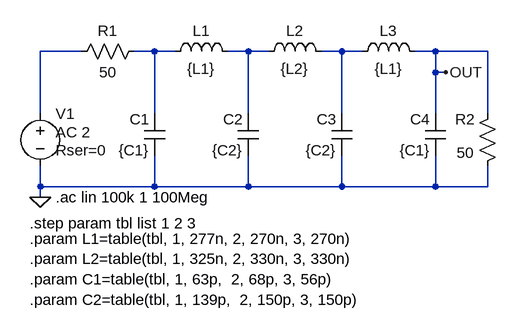
[diagram p0: schematic 40MHzLP.asc]
40MHzLP.asc, the LTspice schematic file:
Version 4
SHEET 1 1248 680
WIRE -336 -208 -400 -208
WIRE -224 -208 -256 -208
WIRE -192 -208 -224 -208
WIRE -80 -208 -112 -208
WIRE -48 -208 -80 -208
WIRE 64 -208 32 -208
WIRE 96 -208 64 -208
WIRE 208 -208 176 -208
WIRE 288 -208 208 -208
WIRE 208 -176 208 -208
WIRE 224 -176 208 -176
WIRE -400 -112 -400 -208
WIRE -224 -112 -224 -208
WIRE -80 -112 -80 -208
WIRE 64 -112 64 -208
WIRE 208 -112 208 -176
WIRE 288 -112 288 -208
WIRE -400 0 -400 -32
WIRE -224 0 -224 -48
WIRE -224 0 -400 0
WIRE -80 0 -80 -48
WIRE -80 0 -224 0
WIRE 64 0 64 -48
WIRE 64 0 -80 0
WIRE 208 0 208 -48
WIRE 208 0 64 0
WIRE 288 0 288 -32
WIRE 288 0 208 0
WIRE -400 16 -400 0
FLAG -400 16 0
FLAG 224 -176 OUT
SYMBOL ind -208 -192 R270
WINDOW 0 32 56 VTop 2
WINDOW 3 5 56 VBottom 2
SYMATTR InstName L1
SYMATTR Value {L1}
SYMBOL voltage -400 -128 R0
WINDOW 3 24 44 Left 2
WINDOW 123 24 44 Left 2
WINDOW 39 24 72 Left 2
SYMATTR Value ""
SYMATTR Value2 AC 2
SYMATTR SpiceLine Rser=0
SYMATTR InstName V1
SYMBOL res -352 -192 R270
WINDOW 0 32 56 VTop 2
WINDOW 3 0 56 VBottom 2
SYMATTR InstName R1
SYMATTR Value 50
SYMBOL cap -208 -48 R180
WINDOW 0 24 56 Left 2
WINDOW 3 24 8 Left 2
SYMATTR InstName C1
SYMATTR Value {C1}
SYMBOL cap -64 -48 R180
WINDOW 0 24 56 Left 2
WINDOW 3 24 8 Left 2
SYMATTR InstName C2
SYMATTR Value {C2}
SYMBOL ind 80 -192 R270
WINDOW 0 32 56 VTop 2
WINDOW 3 5 56 VBottom 2
SYMATTR InstName L3
SYMATTR Value {L1}
SYMBOL cap 224 -48 R180
WINDOW 0 24 56 Left 2
WINDOW 3 24 8 Left 2
SYMATTR InstName C4
SYMATTR Value {C1}
SYMBOL res 304 -128 M0
WINDOW 0 35 24 Left 2
SYMATTR InstName R2
SYMATTR Value 50
SYMBOL ind -64 -192 R270
WINDOW 0 32 56 VTop 2
WINDOW 3 5 56 VBottom 2
SYMATTR InstName L2
SYMATTR Value {L2}
SYMBOL cap 80 -48 R180
WINDOW 0 24 56 Left 2
WINDOW 3 24 8 Left 2
SYMATTR InstName C3
SYMATTR Value {C2}
TEXT -376 16 Left 2 !.ac lin 100k 1 100Meg
TEXT -416 80 Left 2 !.param L1=table(tbl, 1, 277n, 2, 270n, 3, 270n)\n.param L2=table(tbl, 1, 325n, 2, 330n, 3, 330n)\n.param C1=table(tbl, 1, 63p,  2, 68p, 3, 56p)\n.param C2=table(tbl, 1, 139p,  2, 150p, 3, 150p)
TEXT -416 56 Left 2 !.step param tbl list 1 2 3

The netlist it stands for:
* 40MHzLP.asc
L1 N002 N003 {L1}
V1 N001 0 AC 2 Rser=0
R1 N001 N002 50
C1 0 N002 {C1}
C2 0 N003 {C2}
L3 N004 OUT {L1}
C4 0 OUT {C1}
R2 OUT 0 50
L2 N003 N004 {L2}
C3 0 N004 {C2}
.ac lin 100k 1 100Meg
.param L1=table(tbl, 1, 277n, 2, 270n, 3, 270n)
.param L2=table(tbl, 1, 325n, 2, 330n, 3, 330n)
.param C1=table(tbl, 1, 63p,  2, 68p, 3, 56p)
.param C2=table(tbl, 1, 139p,  2, 150p, 3, 150p)
.step param tbl list 1 2 3
.backanno
.end